# Altium schematic sheet PIC18F97J94.SchDoc
size A3; SheetNumber: 1; SheetTotal: 1
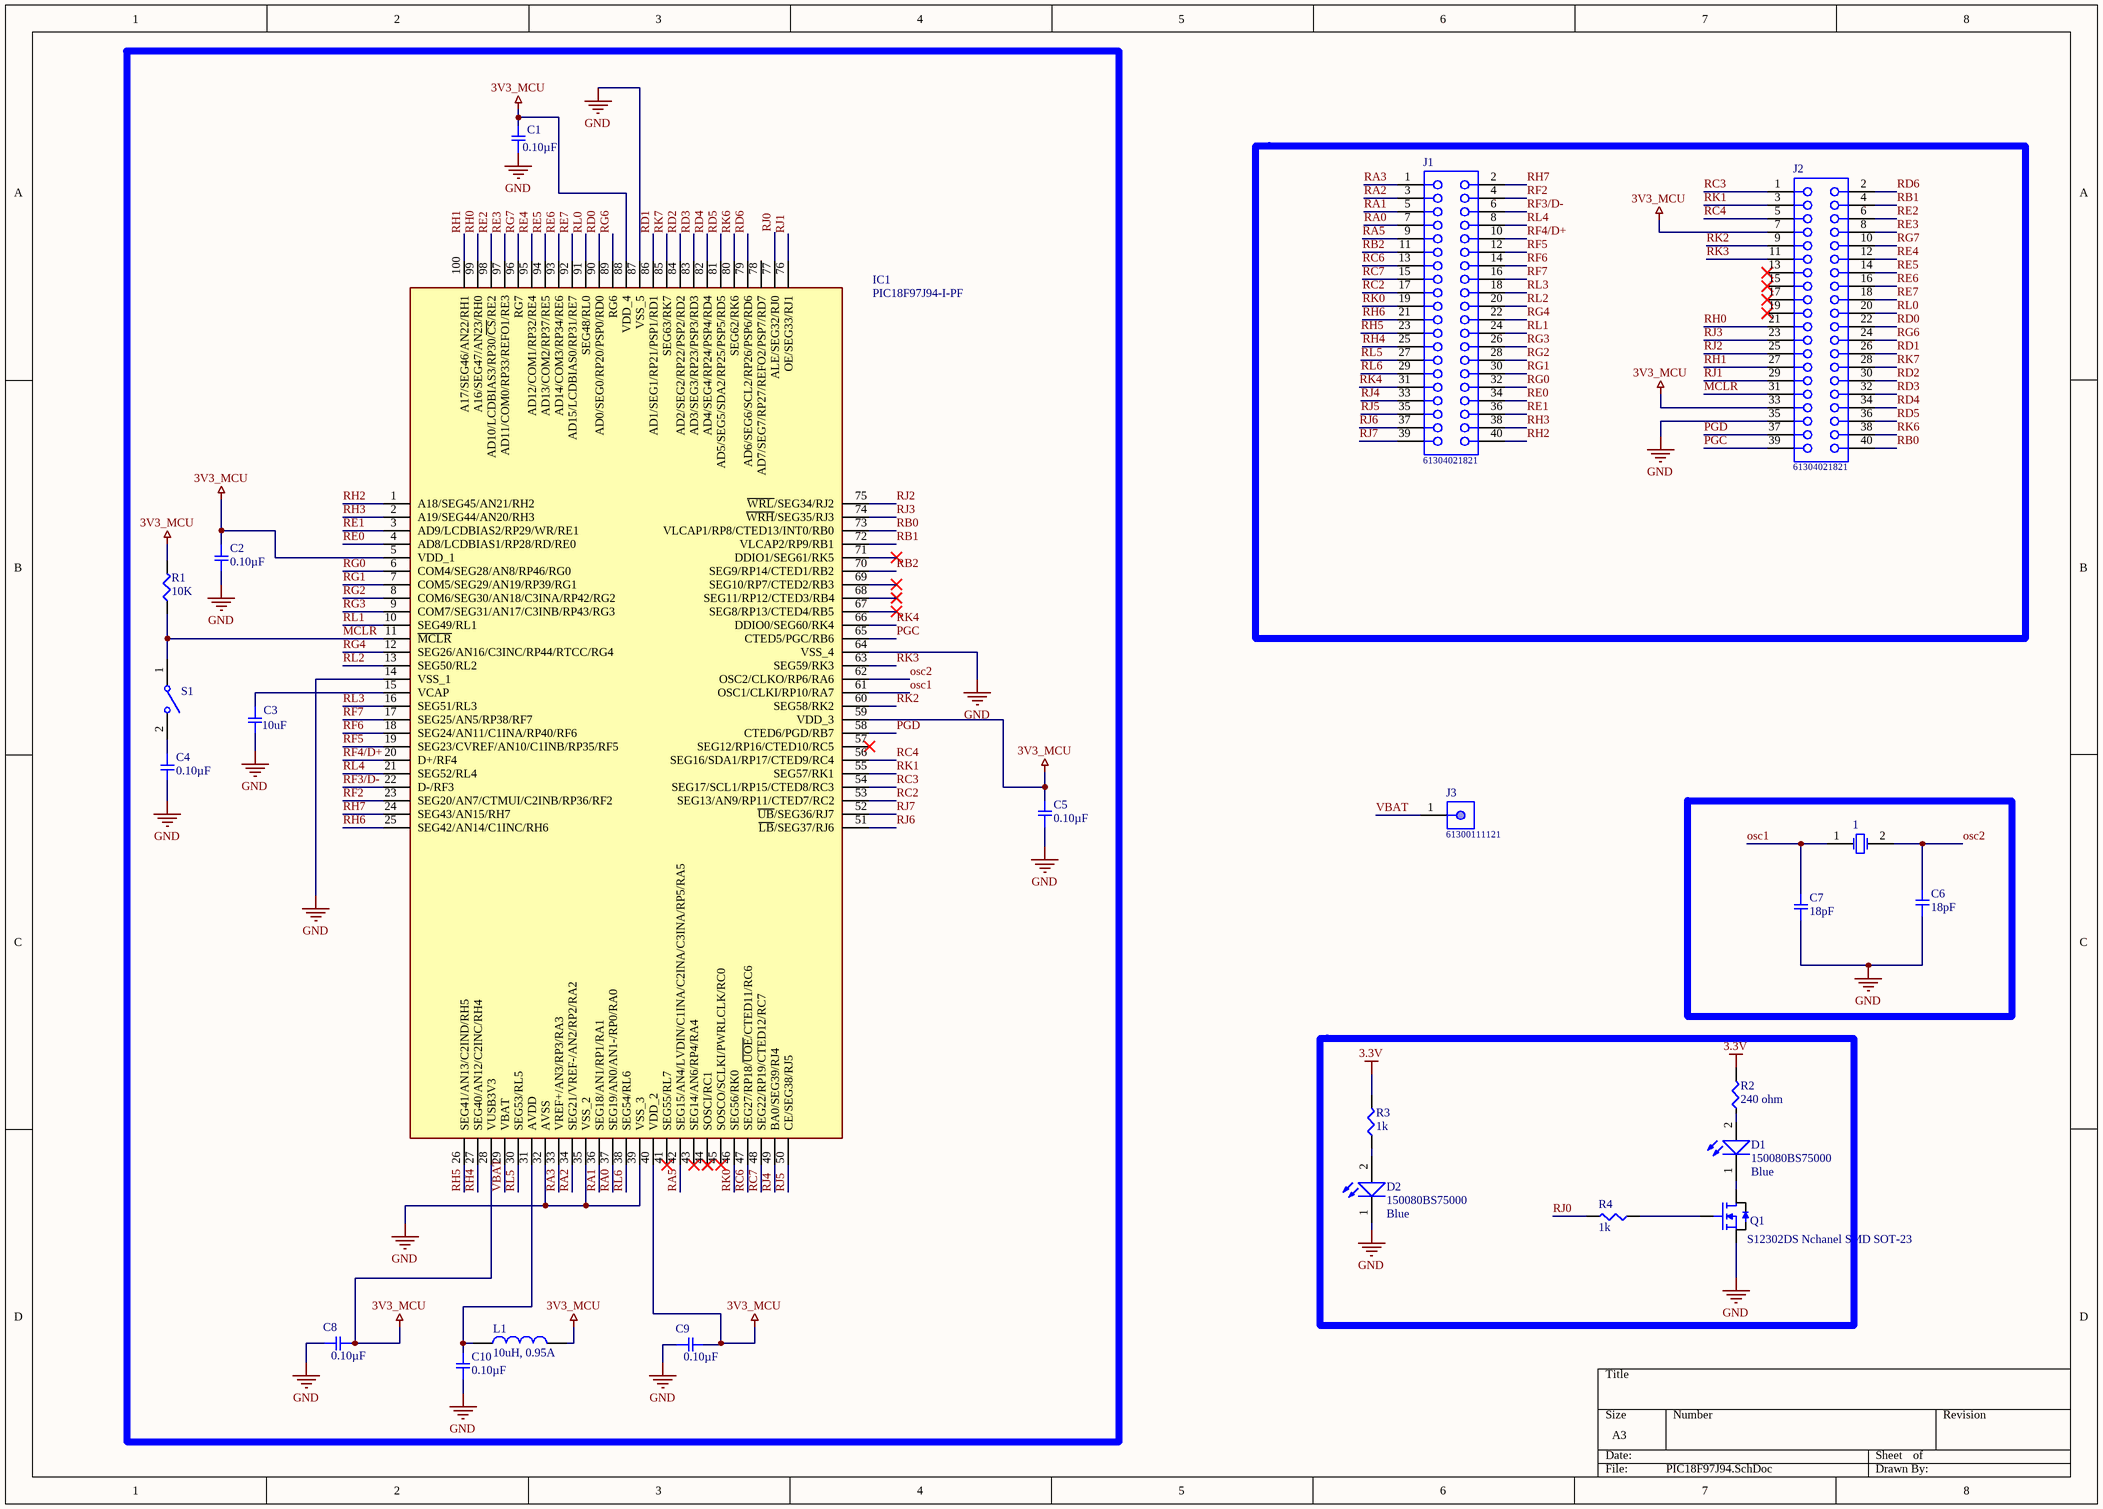
[diagram p0: PIC18F97J94.SchDoc]

## Parts
1  (no value)  [Mini Crystal]
C1  0.10µF  [SMD-0805C]
C2  0.10µF  [SMD-0805C]
C3  10uF  [SMD-0805C]
C4  0.10µF  [SMD-0805C]
C5  0.10µF  [SMD-0805C]
C6  18pF  [SMD-0805C]
C7  18pF  [SMD-0805C]
C8  0.10µF  [SMD-0805C]
C9  0.10µF  [SMD-0805C]
C10  0.10µF  [SMD-0805C]
D1  150080BS75000  Emitting Color: Blue  [WL-SMCW_0805]
D2  150080BS75000  Emitting Color: Blue  [WL-SMCW_0805]
IC1  PIC18F97J94-I-PF  [QFP50P1600X1600X120-100N]
J1  61304021821  [61304021821]
J2  61304021821  [61304021821]
J3  61300111121  [61300111121]
L1  10uH, 0.95A  [WE-LQ_1812]
Q1  S12302DS Nchanel SMD SOT-23  [SOT-23-3N]
R1  10K  [SMD-0805-RES]
R2  240 ohm  [SMD-0805-RES]
R3  1k  [SMD-0805-RES]
R4  1k  [SMD-0805-RES]
S1  434113043826  [434113043826]  (value not drawn)

## Nets
3.3V: R2.2 R3.2
3V3_MCU: C1.2 C2.1 C5.2 C8.2 C9.2 IC1.5(VDD_1) IC1.28(VUSB3V3) IC1.40(VDD_2) IC1.59(VDD_3) IC1.88(VDD_4) J2.7 J2.33 L1.2 R1.2
GND: C1.1 C2.2 C3.2 C4.2 C5.1 C6.1 C7.1 C8.1 C9.1 C10.1 D2.1(K) IC1.14(VSS_1) IC1.32(AVSS) IC1.35(VSS_2) IC1.39(VSS_3) IC1.64(VSS_4) IC1.87(VSS_5) J2.35 Q1.2(Source)
MCLR: IC1.11(~{MCLR}) J2.31 R1.1 S1.1
osc1: 1.1(X1) C7.2 IC1.61(OSC1/CLKI/RP10/RA7)
osc2: 1.2(X2) C6.2 IC1.62(OSC2/CLKO/RP6/RA6)
PGC: IC1.65(CTED5/PGC/RB6) J2.39
PGD: IC1.58(CTED6/PGD/RB7) J2.37
RA0: IC1.37(SEG19/AN0/AN1-/RP0/RA0) J1.7
RA1: IC1.36(SEG18/AN1/RP1/RA1) J1.5
RA2: IC1.34(SEG21/VREF-/AN2/RP2/RA2) J1.3
RA3: IC1.33(VREF+/AN3/RP3/RA3) J1.1
RA5: IC1.42(SEG15/AN4/LVDIN/C1INA/C2INA/C3INA/RP5/RA5) J1.9
RB0: IC1.73(VLCAP1/RP8/CTED13/INT0/RB0) J2.40
RB1: IC1.72(VLCAP2/RP9/RB1) J2.4
RB2: IC1.70(SEG9/RP14/CTED1/RB2) J1.11
RC2: IC1.53(SEG13/AN9/RP11/CTED7/RC2) J1.17
RC3: IC1.54(SEG17/SCL1/RP15/CTED8/RC3) J2.1
RC4: IC1.56(SEG16/SDA1/RP17/CTED9/RC4) J2.5
RC6: IC1.47(SEG27/RP18/~{UOE}/CTED11/RC6) J1.13
RC7: IC1.48(SEG22/RP19/CTED12/RC7) J1.15
RD0: IC1.90(AD0/SEG0/RP20/PSP0/RD0) J2.22
RD1: IC1.86(AD1/SEG1/RP21/PSP1/RD1) J2.26
RD2: IC1.84(AD2/SEG2/RP22/PSP2/RD2) J2.30
RD3: IC1.83(AD3/SEG3/RP23/PSP3/RD3) J2.32
RD4: IC1.82(AD4/SEG4/RP24/PSP4/RD4) J2.34
RD5: IC1.81(AD5/SEG5/SDA2/RP25/PSP5/RD5) J2.36
RD6: IC1.79(AD6/SEG6/SCL2/RP26/PSP6/RD6) J2.2
RE0: IC1.4(AD8/LCDBIAS1/RP28/RD/RE0) J1.34
RE1: IC1.3(AD9/LCDBIAS2/RP29/WR/RE1) J1.36
RE2: IC1.98(AD10/LCDBIAS3/RP30/~{CS}/RE2) J2.6
RE3: IC1.97(AD11/COM0/RP33/REFO1/RE3) J2.8
RE4: IC1.95(AD12/COM1/RP32/RE4) J2.12
RE5: IC1.94(AD13/COM2/RP37/RE5) J2.14
RE6: IC1.93(AD14/COM3/RP34/RE6) J2.16
RE7: IC1.92(AD15/LCDBIAS0/RP31/RE7) J2.18
RF2: IC1.23(SEG20/AN7/CTMUI/C2INB/RP36/RF2) J1.4
RF3/D-: IC1.22(D-/RF3) J1.6
RF4/D+: IC1.20(D+/RF4) J1.10
RF5: IC1.19(SEG23/CVREF/AN10/C1INB/RP35/RF5) J1.12
RF6: IC1.18(SEG24/AN11/C1INA/RP40/RF6) J1.14
RF7: IC1.17(SEG25/AN5/RP38/RF7) J1.16
RG0: IC1.6(COM4/SEG28/AN8/RP46/RG0) J1.32
RG1: IC1.7(COM5/SEG29/AN19/RP39/RG1) J1.30
RG2: IC1.8(COM6/SEG30/AN18/C3INA/RP42/RG2) J1.28
RG3: IC1.9(COM7/SEG31/AN17/C3INB/RP43/RG3) J1.26
RG4: IC1.12(SEG26/AN16/C3INC/RP44/RTCC/RG4) J1.22
RG6: IC1.89(RG6) J2.24
RG7: IC1.96(RG7) J2.10
RH0: IC1.99(A16/SEG47/AN23/RH0) J2.21
RH1: IC1.100(A17/SEG46/AN22/RH1) J2.27
RH2: IC1.1(A18/SEG45/AN21/RH2) J1.40
RH3: IC1.2(A19/SEG44/AN20/RH3) J1.38
RH4: IC1.27(SEG40/AN12/C2INC/RH4) J1.25
RH5: IC1.26(SEG41/AN13/C2IND/RH5) J1.23
RH6: IC1.25(SEG42/AN14/C1INC/RH6) J1.21
RH7: IC1.24(SEG43/AN15/RH7) J1.2
RJ0: IC1.77(ALE/SEG32/RJ0) R4.2
RJ1: IC1.76(OE/SEG33/RJ1) J2.29
RJ2: IC1.75(~{WRL}/SEG34/RJ2) J2.25
RJ3: IC1.74(~{WRH}/SEG35/RJ3) J2.23
RJ4: IC1.49(BA0/SEG39/RJ4) J1.33
RJ5: IC1.50(CE/SEG38/RJ5) J1.35
RJ6: IC1.51(~{LB}/SEG37/RJ6) J1.37
RJ7: IC1.52(~{UB}/SEG36/RJ7) J1.39
RK0: IC1.46(SEG56/RK0) J1.19
RK1: IC1.55(SEG57/RK1) J2.3
RK2: IC1.60(SEG58/RK2) J2.9
RK3: IC1.63(SEG59/RK3) J2.11
RK4: IC1.66(DDIO0/SEG60/RK4) J1.31
RK6: IC1.80(SEG62/RK6) J2.38
RK7: IC1.85(SEG63/RK7) J2.28
RL0: IC1.91(SEG48/RL0) J2.20
RL1: IC1.10(SEG49/RL1) J1.24
RL2: IC1.13(SEG50/RL2) J1.20
RL3: IC1.16(SEG51/RL3) J1.18
RL4: IC1.21(SEG52/RL4) J1.8
RL5: IC1.30(SEG53/RL5) J1.27
RL6: IC1.38(SEG54/RL6) J1.29
VBAT: IC1.29(VBAT) J3.1
NetC3_1: C3.1 IC1.15(VCAP)
NetC4_1: C4.1 S1.2
NetC10_2: C10.2 IC1.31(AVDD) L1.1
NetD1_1: D1.1(K) Q1.3(Drain)
NetD1_2: D1.2(A) R2.1
NetD2_2: D2.2(A) R3.1
NetQ1_1: Q1.1(Gate) R4.1

Not connected (* = marked no-connect by the designer): IC1 41(SEG55/RL7)* 43(SEG14/AN6/RP4/RA4)* 44(SOSCI/RC1)* 45(SOSCO/SCLKI/PWRLCLK/RC0)* 57(SEG12/RP16/CTED10/RC5)* 67(SEG8/RP13/CTED4/RB5)* 68(SEG11/RP12/CTED3/RB4)* 69(SEG10/RP7/CTED2/RB3)* 71(DDIO1/SEG61/RK5)* 78(AD7/SEG7/RP27/REFO2/PSP7/RD7); J2 13* 15* 17* 19*

## Library data of the parts
1 = Mini Crystal: 9B-64.000MBBK-B; Manufacturer: Abracon; PartNumber: ABLS2-4.096MHZ-D4Y-T; Operation Mode: Fundamental or 3rd Overtone; Shunt Capacitance: 7 pF Max.; Freq. Stability: +/- 30 ppm; Packing: Tape and Reel; ESR: 180 Ohm; Load Capacitance: 18 pF; Frequency: 4.096 MHz; Mounting Technology: Surface Mount; PackageDescription: 2-Pin SMD, Body 11.4 x 4.7 mm, Height 3.3 mm; ComponentLink1URL: http://www.abracon.com/; ComponentLink2Description: Datasheet; Operating Temp. Range: -40 to 85 degC; RoHS: TRUE; PackageReference: ABLS2-2; DatasheetVersion: Rev. 03.31.11; Freq. Tolerance: +/- 30 ppm; ComponentLink2URL: http://www.abracon.com/Resonators/ABLS2.pdf; ComponentLink1Description: Manufacturer URL
C1 C2 C4 C5 C8-C10 = GCD21BR71H104KA01L: CAP CER 0.1UF 50V X7R 0805; Manufacturer: Murata Electronics North America; Factory Stock: 0; Unit Price (USD): 0.24; Minimum Quantity: 1; Tolerance: ±10%; Datasheets: http://www.murata.com/~/media/webrenewal/support/library/catalog/products/capacitor/mlcc/c03e.ashx; Image: //media.digikey.com/Renders/Murata%20Renders/0805%28GxM6%29.jpg; Digi-Key Part Number: 490-11955-1-ND; Part Number: GCD21BR71H104KA01L; Quantity Available: 157; @ qty: 0; Packaging: Cut Tape (CT); Series: GCD; Part Status: Active; Value: 0.10µF; Voltage: 50V; Temperature Coefficient: X7R; Operating Temperature: -55°C ~ 125°C; Features: -; Ratings: AEC-Q200; Applications: Automotive; Mounting Type: Surface Mount, MLCC; Package / Case: 0805 (2012 Metric); Size / Dimension: 0.079" L x 0.049" W (2.00mm x 1.25mm); Height - Seated (Max): -; Thickness (Max): 0.049" (1.25mm); Lead Spacing: -; Lead Style: -
C3 C6 C7 = GCD21BR71H104KA01L: CAP CER 0.1UF 50V X7R 0805; Manufacturer: Murata Electronics North America; Factory Stock: 0; Unit Price (USD): 0.24; Minimum Quantity: 1; Value: 0.10µF; Tolerance: ±10%; Datasheets: http://www.murata.com/~/media/webrenewal/support/library/catalog/products/capacitor/mlcc/c03e.ashx; Image: //media.digikey.com/Renders/Murata%20Renders/0805%28GxM6%29.jpg; Digi-Key Part Number: 490-11955-1-ND; Part Number: GCD21BR71H104KA01L; Quantity Available: 157; @ qty: 0; Packaging: Cut Tape (CT); Series: GCD; Part Status: Active; Voltage: 50V; Temperature Coefficient: X7R; Operating Temperature: -55°C ~ 125°C; Features: -; Ratings: AEC-Q200; Applications: Automotive; Mounting Type: Surface Mount, MLCC; Package / Case: 0805 (2012 Metric); Size / Dimension: 0.079" L x 0.049" W (2.00mm x 1.25mm); Height - Seated (Max): -; Thickness (Max): 0.049" (1.25mm); Lead Spacing: -; Lead Style: -
D1 D2 = 150080BS75000: WL-SMCW SMD Mono-color Chip LED Waterclear, size 0805, Blue; Forward Voltage: 3.2 V; Viewing Angle: 140°; Peak Wavelength: 465 nm; Published Date: Jan 2017; Publisher: Wurth Elektronik; ComponentLink1Description: Manufacturer; ComponentLink1URL: http://www.we-online.de; ComponentLink2Description: Datasheet; ComponentLink2URL: http://katalog.we-online.de/led/datasheet/150080BS75000.pdf; Part Number: 150080BS75000; Size: 0805
IC1 = PIC18F97J94-I-PF: Integrated Circuit; Manufacturer_Name: Microchip; Datasheet Link: http://ww1.microchip.com/downloads/en/DeviceDoc/30000575C.pdf; Height: 1.2mm; Manufacturer_Part_Number: PIC18F97J94-I-PF; Mouser Part Number: 579-PIC18F97J94-I/PF; Mouser Price/Stock: http://www.mouser.com/Search/ProductDetail.aspx?qs=X98pPdo4MrvAjQYCsjfLPg%3d%3d
J1 J2 = 61304021821: WR-PHD Socket Header, THT, pitch 2.54mm, Dual Row, Vertical, 40pin; Pin Number: 40; Gender: Female; Rated Current: 3A; Working Voltage: 250VAC; Withstanding Voltage: 500VAC; Contact Resistance: 20mOhm; ComponentLink1Description: Manufacturer; ComponentLink1URL: http://www.we-online.de; ComponentLink2Description: Datasheet; ComponentLink2URL: https://katalog.we-online.de/em/datasheet/6130xx21821.pdf; Part Number: 61304021821; Published Date: June 2019; Publisher: Wurth Elektronik; Pitch: 2.54mm; Operating Temperature: -40 to +125degC; Mounting Technology: THT; Packaging: Tray; Row Number: Dual; Orientation: Vertical
J3 = 61300111121: WR-PHD Pin Header, THT, pitch 2.54mm, Single Row, Vertical, 1pin; Pin Number: 1; Gender: Male; Rated Current: 3A; Working Voltage: 250VAC; Withstanding Voltage: 500VAC; Contact Resistance: 20mOhm; ComponentLink1Description: Manufacturer; ComponentLink1URL: http://www.we-online.de; ComponentLink2Description: Datasheet; ComponentLink2URL: https://katalog.we-online.de/em/datasheet/6130xx11121.pdf; Part Number: 61300111121; Published Date: June 2019; Publisher: Wurth Elektronik; Pitch: 2.54mm; Operating Temperature: -40 to +105degC; Mounting Technology: THT; Packaging: Bag; Row Number: Single; Orientation: Vertical
L1 = 744045100: WE-LQ SMT Inductor, size 1812, 10uH, 0.95A; Manufacturer: Wurth Elektronik; DC Resistance max.: 0.3Ohm; Self Resonant Frequency: 30MHz; Q-Factor: 48; Saturation Current: 1.5A; ComponentLink1Description: Manufacturer; ComponentLink1URL: http://www.we-online.de; ComponentLink2Description: Datasheet; ComponentLink2URL: https://www.we-online.com/catalog/datasheet/744045100.pdf; Operating Temperature: -40 to +125degC; Packaging: Tape and Reel; Published Date: April 2020; Rated Current: 0.95A; Size: 1812; Inductance: 10uH; Manufacturer Part Number: 744045100; Mounting Technology: SMT
Q1 = S12302DS: S12302DS Nchanel SMD SOT-23. VDS MAX 20. 400Ma DI
R1-R4 = ERJ-6ENF1001V: RES SMD 1K OHM 1% 1/8W 0805; Manufacturer: Panasonic Electronic Components; Factory Stock: 0; Unit Price (USD): 0.00729; @ qty: 1500; Minimum Quantity: 1; Power (Watts): 0.125W, 1/8W; Temperature Coefficient: ±100ppm/°C; Part Number: ERJ-6ENF1001V; Datasheets: http://industrial.panasonic.com/www-cgi/jvcr13pz.cgi?E+PZ+3+AOA0002+ERJ6ENF1001V+7+WW; Image: //media.digikey.com/Renders/Panasonic%20Renders/ERJ-0805%20Pkg.jpg; Digi-Key Part Number: P1.00KCCT-ND; Quantity Available: 12895103; Packaging: Cut Tape (CT); Series: ERJ; Part Status: Active; Value: 1k; Tolerance: ±1%; Composition: Thick Film; Features: Automotive AEC-Q200; Operating Temperature: -55°C ~ 155°C; Package / Case: 0805 (2012 Metric); Supplier Device Package: 0805; Size / Dimension: 0.079" L x 0.049" W (2.00mm x 1.25mm); Height - Seated (Max): 0.028" (0.70mm); Number of Terminations: 2; Failure Rate: -
S1 = 434113043826: WS-TASV J-Bend SMT Tact Switch 6x3.5mm, height 4.3mm, 260gf; Rated Voltage: 12VDC; Rated Current: 50mA; Washable: No; ComponentLink1Description: Manufacturer; ComponentLink1URL: http://www.we-online.de; ComponentLink2Description: Datasheet; ComponentLink2URL: https://katalog.we-online.com/em/datasheet/434113043826.pdf; Operating Temperature: -40 to +85degC; Part Number: 434113043826; Published Date: September 2019; Contact Material: Stainless Steel; Height: 4.3mm; Mounting Technology: SMT; Contact Plating: Silver; Operation Force: 260gf; Packaging: Tape and Reel; Terminal Material: Copper Alloy; Publisher: Wurth Elektronik; Terminal Plating: Silver